# Altium schematic sheet 信号采集板.SchDoc
size A2; PageSetup: Record=PageOptions|CenterHorizontal=True|CenterVertical=True|PrintScale=0.50|XCorrection=1.00|YCorrection=1.00|PrintKind=1|BorderSize=5000000|LeftOffset=0|BottomOffset=0|Orientation=2|PaperLength=1000|PaperWidth=1000|Scale=100|PaperSource=15|PrintQuality=600|MediaType=1|DitherType=10|PaperKind=A3|PrintScaleMode=1
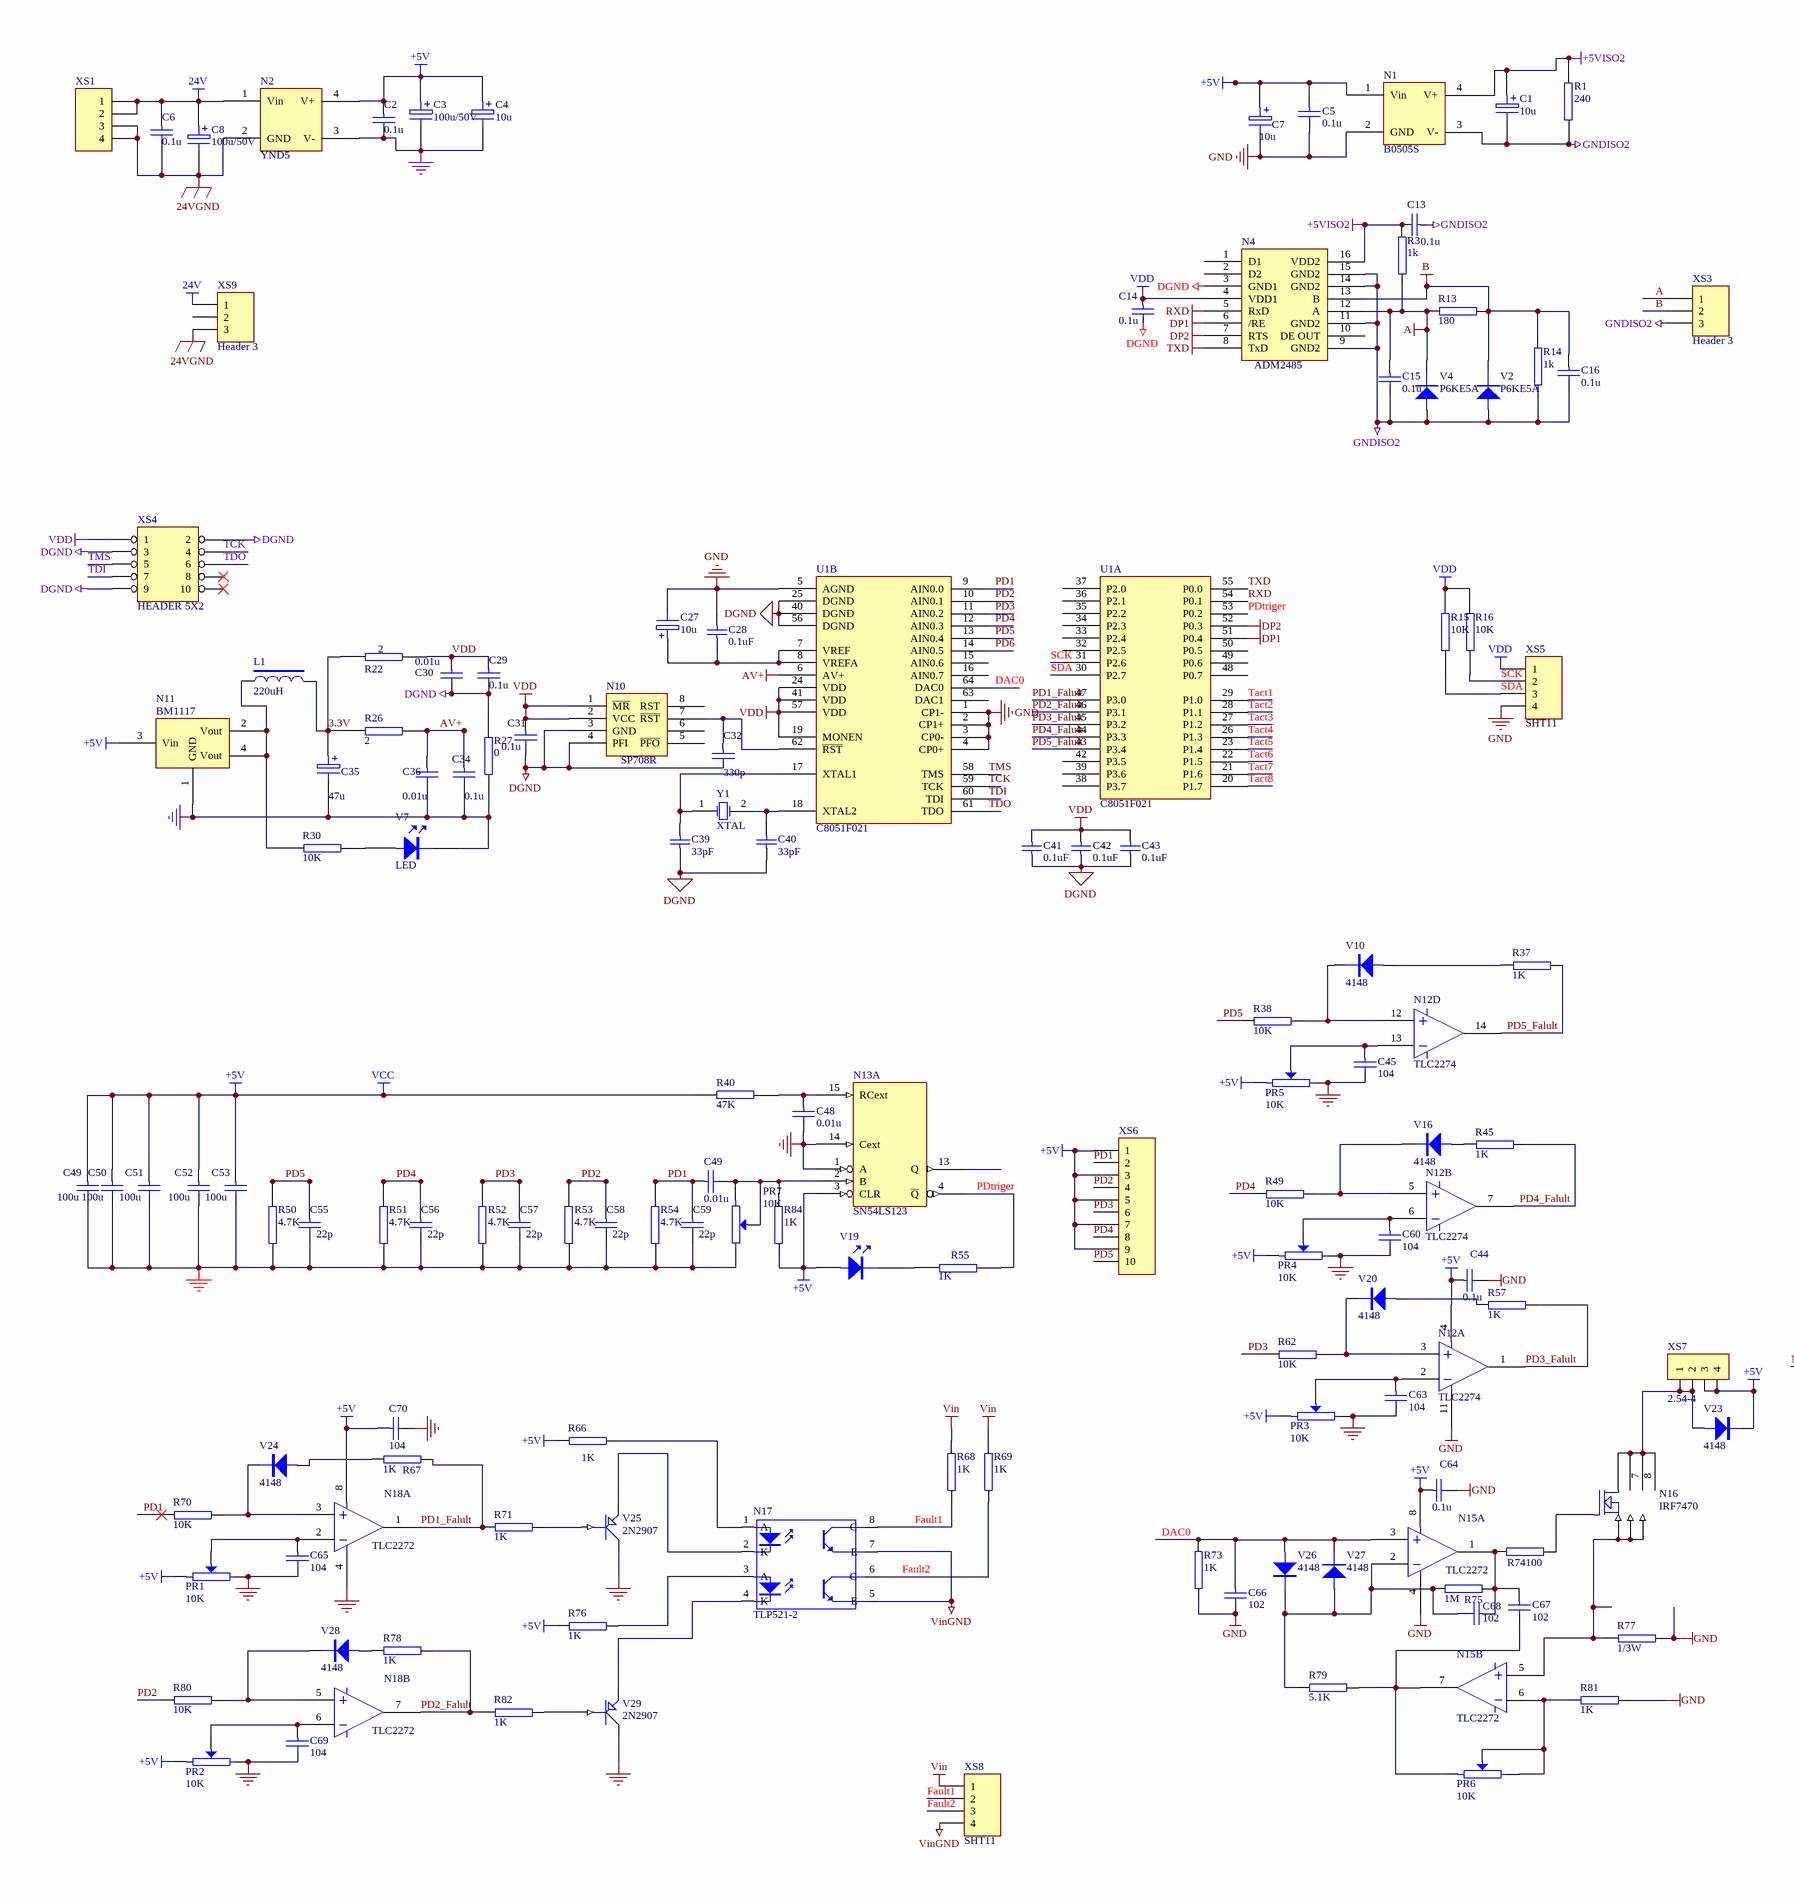
[diagram p0: 信号采集板.SchDoc, left]
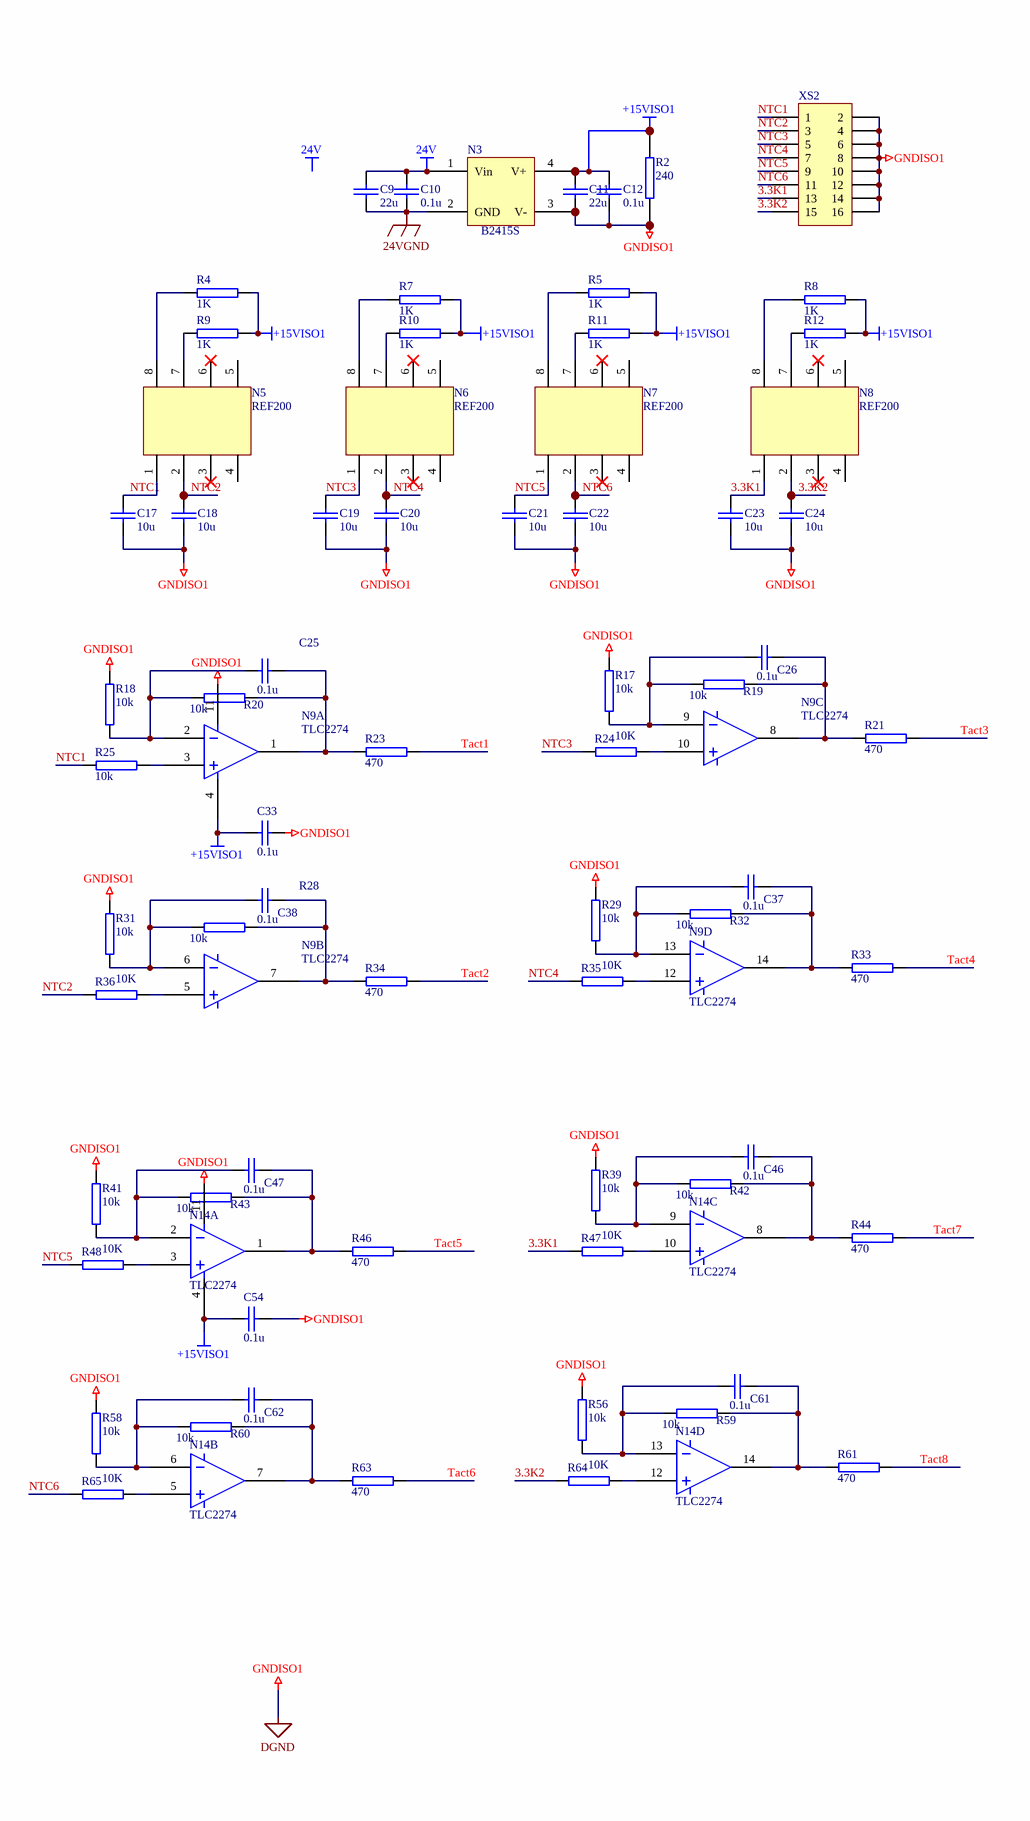
[diagram p1: 信号采集板.SchDoc, right]

## Parts
(Parts that share a designator on the sheet are numbered #1, #2 ... from top to bottom, then left to right.)
C1  10u  [1812]
C2  0.1u  [1206]
C3  100u/50V  [RB3.5-8]
C4  10u  [1812]
C5  0.1u  [0805]
C6  0.1u  [1206]
C7  10u  [1812]
C8  100u/50V  [RB3.5-8]
C9  22u  [1812]
C10  0.1u  [0805]
C11  22u  [1812]
C12  0.1u  [0805]
C13  0.1u  [0805]
C14  0.1u  [0805]
C15  0.1u  [0805]
C16  0.1u  [0805]
C17  10u  [0805]
C18  10u  [0805]
C19  10u  [0805]
C20  10u  [0805]
C21  10u  [0805]
C22  10u  [0805]
C23  10u  [0805]
C24  10u  [0805]
C25  0.1u  [0805]
C26  0.1u  [0805]
C27  10u  [1206A]
C28  0.1uF  [0805]
C29  0.1u  [0805]
C30  0.01u  [0805]
C31  0.1u  [0805]
C32  330p  [0805]
C33  0.1u  [0805]
C34  0.1u  [0805]
C35  47u  [1812]
C36  0.01u  [0805]
C37  0.1u  [0805]
C38  0.1u  [0805]
C39  33pF  [0805]
C40  33pF  [0805]
C41  0.1uF  [0805]
C42  0.1uF  [0805]
C43  0.1uF  [0805]
C44  0.1u  [0805]
C45  104  [0805]
C46  0.1u  [0805]
C47  0.1u  [0805]
C48  0.01u  [0805]
C49#1  100u  [1812]
C49#2  0.01u  [0805]
C50  100u  [1812]
C51  100u  [1812]
C52  100u  [1812]
C53  100u  [1812]
C54  0.1u  [0805]
C55  22p  [0805]
C56  22p  [0805]
C57  22p  [0805]
C58  22p  [0805]
C59  22p  [0805]
C60  104  [0805]
C61  0.1u  [0805]
C62  0.1u  [0805]
C63  104  [0805]
C64  0.1u  [0805]
C65  104  [0805]
C66  102  [0805]
C67  102  [0805]
C68  102  [0805]
C69  104  [0805]
C70  104  [0805]
L1  220uH  [1812]
N1  B0505S  [B0505LM]
N2  YND5  [YND5]
N3  B2415S  [B0505LM]
N4  ADM2485  [SOIC-16]
N5  REF200  [SO-8]
N6  REF200  [SO-8]
N7  REF200  [SO-8]
N8  REF200  [SO-8]
N9  TLC2274  [SO-14]  (parts A,B,C,D of 4)
N10  SP708R  [SO-8]
N11  BM1117  [SOT-223]
N12  TLC2274  [SO-14]  (parts A,B,D of 4)
N13  SN54LS123  [SO-16]  (part A of 2)
N14  TLC2274  [SO-14]  (parts A,B,C,D of 4)
N15  TLC2272  [SO-8]  (parts A,B of 2)
N16  IRF7470  [SO-8]
N17  TLP521-2  [ILEAD-8]
N18  TLC2272  [SO-8]  (parts A,B of 2)
PR1  10K  [3296-1]
PR2  10K  [3296-1]
PR3  10K  [3296-1]
PR4  10K  [3296-1]
PR5  10K  [3296-1]
PR6  10K  [3296-1]
PR7  10K  [3296-1]
R1  240  [1206]
R2  240  [1206]
R3  1k  [0805]
R4  1K  [0805]
R5  1K  [0805]
R7  1K  [0805]
R8  1K  [0805]
R9  1K  [0805]
R10  1K  [0805]
R11  1K  [0805]
R12  1K  [0805]
R13  180  [0805]
R14  1k  [0805]
R15  10K  [0805]
R16  10K  [0805]
R17  10k  [0805]
R18  10k  [0805]
R19  10k  [0805]
R20  10k  [0805]
R21  470  [0805]
R22  2  [1210]
R23  470  [0805]
R24  10K  [0805]
R25  10k  [0805]
R26  2  [1210]
R27  0  [1206]
R28  10k  [0805]
R29  10k  [0805]
R30  10K  [0805]
R31  10k  [0805]
R32  10k  [0805]
R33  470  [0805]
R34  470  [0805]
R35  10K  [0805]
R36  10K  [0805]
R37  1K  [0805]
R38  10K  [0805]
R39  10k  [0805]
R40  47K  [0805]
R41  10k  [0805]
R42  10k  [0805]
R43  10k  [0805]
R44  470  [0805]
R45  1K  [0805]
R46  470  [0805]
R47  10K  [0805]
R48  10K  [0805]
R49  10K  [0805]
R50  4.7K  [0805]
R51  4.7K  [0805]
R52  4.7K  [0805]
R53  4.7K  [0805]
R54  4.7K  [0805]
R55  1K  [0805]
R56  10k  [0805]
R57  1K  [0805]
R58  10k  [0805]
R59  10k  [0805]
R60  10k  [0805]
R61  470  [0805]
R62  10K  [0805]
R63  470  [0805]
R64  10K  [0805]
R65  10K  [0805]
R66  1K  [0805]
R67  1K  [0805]
R68  1K  [0805]
R69  1K  [0805]
R70  10K  [0805]
R71  1K  [0805]
R73  1K  [0805]
R74  100  [0805]
R75  1M  [0805]
R76  1K  [0805]
R77  1/3W  [1812]
R78  1K  [0805]
R79  5.1K  [0805]
R80  10K  [0805]
R81  1K  [0805]
R82  1K  [0805]
R84  1K  [0805]
U1  C8051F021  [TQFP-64]  (parts A,B of 2)
V2  P6KE5A  [1206-D]
V4  P6KE5A  [1206-D]
V7  LED  [1206A]
V10  4148  [1206-D]
V16  4148  [1206-D]
V19  LED  [1206a]  (value not drawn)
V20  4148  [1206-D]
V23  4148  [1206-D]
V24  4148  [1206-D]
V25  2N2907  [SOT-23]
V26  4148  [1206-D]
V27  4148  [1206-D]
V28  4148  [1206-D]
V29  2N2907  [SOT-23]
XS1  Header 4  [SIP-4]  (value not drawn)
XS2  Header 8X2  [HDR2X8]  (value not drawn)
XS3  Header 3  [SIP-3]
XS4  HEADER 5X2  [IDC-10]
XS5  SHT11  [SIP-4]
XS6  Header 10  [SIP-10]  (value not drawn)
XS7  2.54-4  [SIP-4]
XS8  SHT11  [SIP-4]
XS9  Header 3  [SIP-3]
Y1  XTAL  [CRY]

## Nets
24V: C6.1 C8.1 C9.1 C10.2 N2.1(Vin) N3.1(Vin) XS1.1 XS1.2 XS9.1
24VGND: C6.2 C8.2 C9.2 C10.1 N2.2(GND) N3.2(GND) XS1.3 XS1.4 XS9.3
+5V: C2.1 C3.1 C4.1 C5.1 C7.1 C44.1 C49#1.1 C50.1 C51.1 C52.1 C53.1 C64.1 C70.1 N1.1(Vin) N2.4(V+) N11.3(Vin) N12.4 N13.3(CLR) N13.16(VCC) N15.8 N18.8 PR1.1 PR2.1 PR3.1 PR4.1 PR5.1 R40.2 R66.1 R76.1 R84.1 V19.1 V23.K XS6.1 XS6.3 XS6.5 XS6.7 XS6.9 XS7.3 XS7.4  [also labelled VCC]
+5VISO2: C1.1 C13.2 N1.4(V+) N4.16(VDD2) R1.2 R3.1
+15VISO1: C11.1 C12.2 C33.1 C54.1 N3.4(V+) N9.4 N14.4 R2.2 R4.1 R5.1 R7.1 R8.1 R9.1 R10.1 R11.1 R12.1
A: C15.1 N4.12(A) R3.2 R13.1 V4.K XS3.1
AV+: C34.1 C36.1 R26.2 U1.6(AV+)
B: C16.1 N4.13(B) R13.2 R14.1 V2.K XS3.2
D: N16.5(D) N16.6(D) N16.7(D) N16.8(D) V23.A XS7.1 XS7.2
DGND: C11.2 C12.1 C14.2 C17.1 C18.1 C19.1 C20.1 C21.1 C22.1 C23.1 C24.1 C29.2 C30.2 C31.2 C32.2 C33.2 C39.1 C40.1 C41.1 C42.1 C43.1 C54.2 N3.3(V-) N4.3(GND1) N9.11 N10.3(GND) N10.4(PFI) N14.11 R2.1 R17.2 R18.2 R27.2 R29.2 R31.2 R39.2 R41.2 R56.2 R58.2 U1.25(DGND) U1.40(DGND) U1.56(DGND) XS2.2 XS2.4 XS2.6 XS2.8 XS2.10 XS2.12 XS2.14 XS2.16 XS4.2 XS4.3 XS4.9  [also labelled GNDISO1]
DP1: N4.6(/RE) U1.51(P0.4)
DP2: N4.7(RTS) U1.52(P0.3)
GND: C2.2 C3.2 C4.2 C5.2 C7.2 C27.2 C28.2 C34.2 C35.2 C36.2 C44.2 C45.2 C48.2 C49#1.2 C50.2 C51.2 C52.2 C53.2 C55.2 C56.2 C57.2 C58.2 C59.2 C60.2 C63.2 C64.2 C65.2 C66.2 C69.2 C70.2 N1.2(GND) N2.3(V-) N11.1(GND) N12.11 N13.1(A) N13.8(GND) N13.14(Cext) N15.4 N18.4 PR1.2 PR2.2 PR3.2 PR4.2 PR5.2 PR7.2 R27.1 R50.1 R51.1 R52.1 R53.1 R54.1 R73.2 R77.2 R81.2 U1.1(CP1-) U1.2(CP1+) U1.3(CP0-) U1.4(CP0+) U1.5(AGND) V7.2 V25.C V29.C XS5.4
GNDISO2: C1.2 C13.1 C15.2 C16.2 N1.3(V-) N4.9(GND2) N4.11(GND2) N4.14(GND2) N4.15(GND2) R1.1 R14.2 V2.A V4.A XS3.3
RXD: N4.5(RxD) U1.54(P0.1)
S: N15.5 N16.1(S) N16.2(S) N16.3(S) R77.1
TXD: N4.8(TxD) U1.55(P0.0)
VDD: C14.1 C29.1 C30.1 C31.1 C41.2 C42.2 C43.2 N4.4(VDD1) N10.1(~{MR}) N10.2(VCC) R15.1 R16.1 R22.2 U1.19(MONEN) U1.24(VDD) U1.41(VDD) U1.57(VDD) XS4.1 XS5.1
Vin: R68.2 R69.2 XS8.1
VinGND: N17.5(E) N17.7(E) XS8.4
3.3K1: C23.2 N8.1 R47.2 XS2.13
3.3K2: C24.2 N8.2 R64.2 XS2.15
3.3V: C35.1 L1.2 R22.1 R26.1
DAC0: C66.1 N15.3 R73.1 U1.64(DAC0) V26.A V27.K
Fault1: N17.8(C) R68.1 XS8.2
Fault2: N17.6(C) R69.1 XS8.3
NTC1: C17.2 N5.1 R25.2 XS2.1
NTC2: C18.2 N5.2 R36.2 XS2.3
NTC3: C19.2 N6.1 R24.2 XS2.5
NTC4: C20.2 N6.2 R35.2 XS2.7
NTC5: C21.2 N7.1 R48.2 XS2.9
NTC6: C22.2 N7.2 R65.2 XS2.11
PD1: C49#2.1 C59.1 R54.2 R70.1 U1.9(AIN0.0) XS6.2
PD1_Falult: N18.1 R67.2 R71.1 U1.47(P3.0)
PD2: C58.1 R53.2 R80.1 U1.10(AIN0.1) XS6.4
PD2_Falult: N18.7 R78.2 R82.1 U1.46(P3.1)
PD3: C57.1 R52.2 R62.1 U1.11(AIN0.2) XS6.6
PD3_Falult: N12.1 R57.2 U1.45(P3.2)
PD4: C56.1 R49.1 R51.2 U1.12(AIN0.3) XS6.8
PD4_Falult: N12.7 R45.2 U1.44(P3.3)
PD5: C55.1 R38.1 R50.2 U1.13(AIN0.4) XS6.10
PD5_Falult: N12.14 R37.2 U1.43(P3.4)
PD6: U1.14(AIN0.5)
PDtriger: N13.4(~{Q}) R55.2 U1.53(P0.2)
SCK: R16.2 U1.31(P2.6) XS5.2
SDA: R15.2 U1.30(P2.7) XS5.3
Tact1: R23.2 U1.29(P1.0)
Tact2: R34.2 U1.28(P1.1)
Tact3: R21.2 U1.27(P1.2)
Tact4: R33.2 U1.26(P1.3)
Tact5: R46.2 U1.23(P1.4)
Tact6: R63.2 U1.22(P1.5)
Tact7: R44.2 U1.21(P1.6)
Tact8: R61.2 U1.20(P1.7)
TCK: U1.59(TCK) XS4.4
TDI: U1.60(TDI) XS4.7
TDO: U1.61(TDO) XS4.6
TMS: U1.58(TMS) XS4.5
NetC25_1: C25.1 N9.2 R18.1 R20.1
NetC25_2: C25.2 N9.1 R20.2 R23.1
NetC26_1: C26.1 N9.9 R17.1 R19.1
NetC26_2: C26.2 N9.8 R19.2 R21.1
NetC27_1: C27.1 C28.1 U1.7(VREF) U1.8(VREFA)
NetC32_1: C32.1 N10.7(~{RST}) U1.62(~{RST})
NetC37_1: C37.1 N9.13 R29.1 R32.1
NetC37_2: C37.2 N9.14 R32.2 R33.1
NetC38_1: C38.1 N9.6 R28.1 R31.1
NetC38_2: C38.2 N9.7 R28.2 R34.1
NetC39_2: C39.2 U1.17(XTAL1) Y1.1(OSC1)
NetC40_2: C40.2 U1.18(XTAL2) Y1.2(OSC2)
NetC45_1: C45.1 N12.13 PR5.W
NetC46_1: C46.1 N14.9 R39.1 R42.1
NetC46_2: C46.2 N14.8 R42.2 R44.1
NetC47_1: C47.1 N14.2 R41.1 R43.1
NetC47_2: C47.2 N14.1 R43.2 R46.1
NetC48_1: C48.1 N13.15(RCext) R40.1
NetC49#2_2: C49#2.2 N13.2(B) PR7.1 PR7.W R84.2
NetC60_1: C60.1 N12.6 PR4.W
NetC61_1: C61.1 N14.13 R56.1 R59.1
NetC61_2: C61.2 N14.14 R59.2 R61.1
NetC62_1: C62.1 N14.6 R58.1 R60.1
NetC62_2: C62.2 N14.7 R60.2 R63.1
NetC63_1: C63.1 N12.2 PR3.W
NetC65_1: C65.1 N18.2 PR1.W
NetC67_1: C67.1 C68.1 N15.1 R74.2 R75.1
NetC67_2: C67.2 N15.7 PR6.1 R79.2
NetC68_2: C68.2 N15.2 R75.2 R79.1 V26.K V27.A
NetC69_1: C69.1 N18.6 PR2.W
NetL1_1: L1.1 N11.2(Vout) N11.4(Vout) R30.1
NetN5_7: N5.7 R9.2
NetN5_8: N5.8 R4.2
NetN6_7: N6.7 R10.2
NetN6_8: N6.8 R7.2
NetN7_7: N7.7 R11.2
NetN7_8: N7.8 R5.2
NetN8_7: N8.7 R12.2
NetN8_8: N8.8 R8.2
NetN9_3: N9.3 R25.1
NetN9_5: N9.5 R36.1
NetN9_10: N9.10 R24.1
NetN9_12: N9.12 R35.1
NetN12_3: N12.3 R62.2 V20.K
NetN12_5: N12.5 R49.2 V16.K
NetN12_12: N12.12 R38.2 V10.K
NetN14_3: N14.3 R48.1
NetN14_5: N14.5 R65.1
NetN14_10: N14.10 R47.1
NetN14_12: N14.12 R64.1
NetN15_6: N15.6 PR6.2 PR6.W R81.1
NetN16_4: N16.4(G) R74.1
NetN17_1: N17.1(A) R66.2
NetN17_2: N17.2(K) V25.E
NetN17_3: N17.3(A) R76.2
NetN17_4: N17.4(K) V29.E
NetN18_3: N18.3 R70.2 V24.K
NetN18_5: N18.5 R80.2 V28.K
NetR30_2: R30.2 V7.1
NetR37_1: R37.1 V10.A
NetR45_1: R45.1 V16.A
NetR55_1: R55.1 V19.2
NetR57_1: R57.1 V20.A
NetR67_1: R67.1 V24.A
NetR71_2: R71.2 V25.B
NetR78_1: R78.1 V28.A
NetR82_2: R82.2 V29.B

Not connected (* = marked no-connect by the designer): N4 1(D1) 2(D2) 10(DE_OUT); N5 3* 4 5 6*; N6 3* 4 5 6*; N7 3* 4 5 6*; N8 3* 4 5 6*; N10 5(~{PFO}) 6 8(RST); N13 13(Q); U1 15(AIN0.6) 16(AIN0.7) 32(P2.5) 33(P2.4) 34(P2.3) 35(P2.2) 36(P2.1) 37(P2.0) 38(P3.7) 39(P3.6) 42(P3.5) 48(P0.7) 49(P0.6) 50(P0.5) 63(DAC1); XS4 8* 10*; XS9 2

## Notes on the sheet
- Labels drawn without touching a wire or pin: 24V

## Library data of the parts
C1 C3 C4 C7 C8 C27 C35 = ELECTRO1: Electrolytic Capacitor
C2 C5 C6 C9 C11 C15 C16 C29-C31 C34 C36 C48 C49#1 C49#2 C50-C53 C55-C59 = CAP: Capacitor
C10 C12-C14 C17-C26 C32 C33 C37 C38 C44-C47 C54 C60-C70 = CAP
C28 C39-C43 = Cap: Capacitor; Published: 8-Jun-2000; LatestRevisionDate: 17-Jul-2002; LatestRevisionNote: Re-released for DXP Platform.; PackageReference: RAD-0.3; Publisher: Altium Limited
  C28 C41-C43: Value: 0.1uF
  C39 C40: Value: 33pF
L1 = L
N1-N3 = B0505LM
N5-N8 = EF200
N9 N12 N14 = LM124
N13 = 74LS123
N15 N18 = 1458
N16 = MOSFET N
N17 = TLP521-2: Optoisolator
PR1-PR7 = POT
R1 R2 R13 R15 R16 R22 R26 R27 R30 R37 R38 R40 R45 R49-R55 R57 R62 R66-R71 R73-R82 R84 = RES2
R3-R5 R7-R12 R14 R17-R21 R23-R25 R28 R29 R31-R36 R39 R41-R44 R46-R48 R56 R58-R61 R63-R65 = R
V2 V4 V10 V16 V20 V23 V24 V26-V28 = DIODE
V25 V29 = PNP2
XS1 XS5 XS8 = Header 4: Header, 4-Pin; LatestRevisionDate: 17-Jul-2002; LatestRevisionNote: Re-released for DXP Platform.; Publisher: Altium Limited
XS2 = Header 8X2: Header, 8-Pin, Dual row; LatestRevisionDate: 17-Jul-2002; LatestRevisionNote: Re-released for DXP Platform.; Publisher: Altium Limited
XS3 XS9 = Header 3: Header, 3-Pin; LatestRevisionDate: 17-Jul-2002; LatestRevisionNote: Re-released for DXP Platform.; Publisher: Altium Limited
XS6 = Header 10: Header, 10-Pin; LatestRevisionDate: 17-Jul-2002; LatestRevisionNote: Re-released for DXP Platform.; Publisher: Altium Limited
XS7 = CON4
Y1 = XTAL: Crystal Oscillator; Published: 8-Jun-2000; LatestRevisionDate: 17-Jul-2002; LatestRevisionNote: Re-released for DXP Platform.; PackageReference: R38; Publisher: Altium Limited; PackageDescription: Crystal, Thru-Hole; 2 Leads; Body 3.1 x 8.2 mm (Dia.xH)